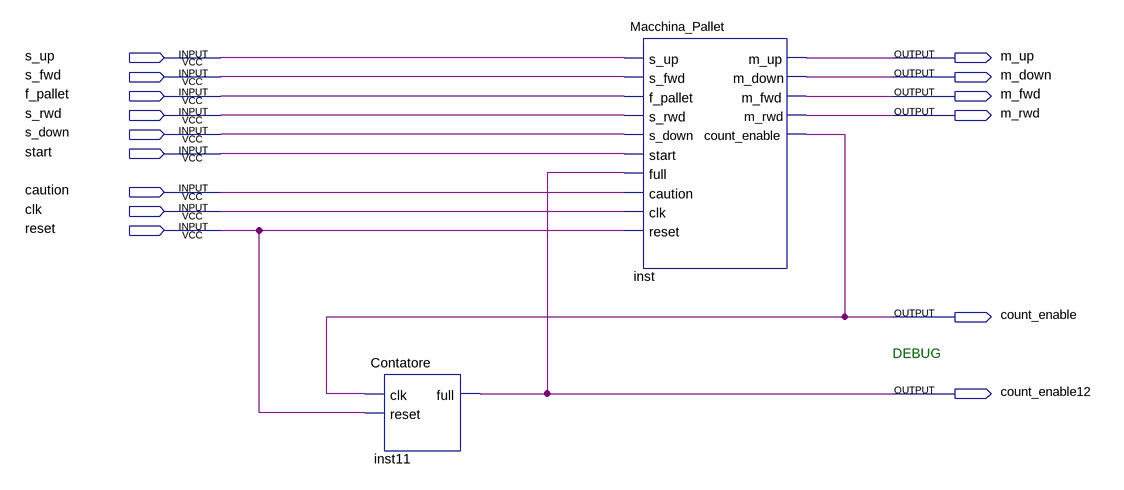
[diagram p0: schematic sheet]
// Quartus schematic PALLET.bdf as structural Verilog: 2 symbols, 15 pins
module PALLET (
  input  s_up,
  input  s_fwd,
  input  f_pallet,
  input  s_rwd,
  input  s_down,
  input  start,
  input  caution,
  input  clk,
  input  reset,
  output m_up,
  output m_down,
  output m_fwd,
  output m_rwd,
  output count_enable,
  output count_enable12
);

  Contatore inst11 (.clk(count_enable), .reset(reset), .full(count_enable12));
  Macchina_Pallet inst (
    .s_up(s_up), .s_fwd(s_fwd), .f_pallet(f_pallet), .s_rwd(s_rwd), .s_down(s_down), .start(start),
    .full(count_enable12), .caution(caution), .clk(clk), .reset(reset), .m_up(m_up), .m_down(m_down),
    .m_fwd(m_fwd), .m_rwd(m_rwd), .count_enable(count_enable));

  // Notes on the sheet:
  //   DEBUG
endmodule
